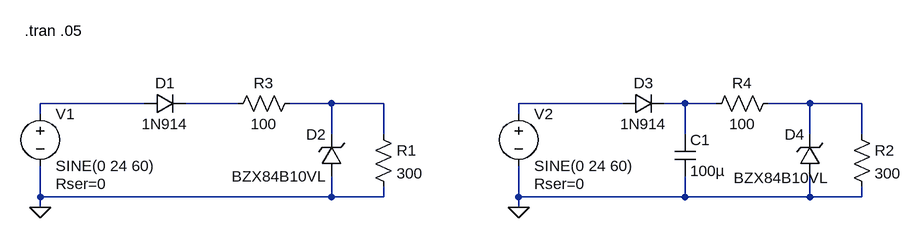
[diagram p0: schematic Diodo - RetificadorMeiaOnda_Regulador_Zener.asc]
Diodo - RetificadorMeiaOnda_Regulador_Zener.asc, the LTspice schematic file:
Version 4
SHEET 1 980 680
WIRE -192 128 -352 128
WIRE -48 128 -128 128
WIRE 96 128 32 128
WIRE 176 128 96 128
WIRE 544 128 384 128
WIRE 640 128 608 128
WIRE 688 128 640 128
WIRE 832 128 768 128
WIRE 912 128 832 128
WIRE -352 144 -352 128
WIRE 384 144 384 128
WIRE 96 176 96 128
WIRE 176 176 176 128
WIRE 640 176 640 128
WIRE 832 176 832 128
WIRE 912 176 912 128
WIRE -352 272 -352 224
WIRE 96 272 96 240
WIRE 96 272 -352 272
WIRE 176 272 176 256
WIRE 176 272 96 272
WIRE 384 272 384 224
WIRE 640 272 640 240
WIRE 640 272 384 272
WIRE 832 272 832 240
WIRE 832 272 640 272
WIRE 912 272 912 256
WIRE 912 272 832 272
WIRE -352 288 -352 272
WIRE 384 288 384 272
FLAG -352 288 0
FLAG 384 288 0
SYMBOL res 160 160 R0
SYMATTR InstName R1
SYMATTR Value 300
SYMBOL diode -192 144 R270
WINDOW 0 32 32 VTop 2
WINDOW 3 0 32 VBottom 2
SYMATTR InstName D1
SYMATTR Value 1N914
SYMBOL voltage -352 128 R0
WINDOW 123 0 0 Left 2
WINDOW 39 24 124 Left 2
SYMATTR SpiceLine Rser=0
SYMATTR InstName V1
SYMATTR Value SINE(0 24 60)
SYMBOL res 48 112 R90
WINDOW 0 0 56 VBottom 2
WINDOW 3 32 56 VTop 2
SYMATTR InstName R3
SYMATTR Value 100
SYMBOL zener 112 240 R180
WINDOW 0 24 64 Left 2
WINDOW 3 24 0 Left 2
SYMATTR InstName D2
SYMATTR Value BZX84B10VL
SYMATTR Description Diode
SYMATTR Type diode
SYMBOL res 896 160 R0
SYMATTR InstName R2
SYMATTR Value 300
SYMBOL diode 544 144 R270
WINDOW 0 32 32 VTop 2
WINDOW 3 0 32 VBottom 2
SYMATTR InstName D3
SYMATTR Value 1N914
SYMBOL voltage 384 128 R0
WINDOW 123 0 0 Left 2
WINDOW 39 24 124 Left 2
SYMATTR SpiceLine Rser=0
SYMATTR InstName V2
SYMATTR Value SINE(0 24 60)
SYMBOL res 784 112 R90
WINDOW 0 0 56 VBottom 2
WINDOW 3 32 56 VTop 2
SYMATTR InstName R4
SYMATTR Value 100
SYMBOL zener 848 240 R180
WINDOW 0 24 64 Left 2
WINDOW 3 -12 -3 Left 2
SYMATTR InstName D4
SYMATTR Value BZX84B10VL
SYMATTR Description Diode
SYMATTR Type diode
SYMBOL cap 624 176 R0
SYMATTR InstName C1
SYMATTR Value 100µ
TEXT -376 16 Left 2 !.tran .05

The netlist it stands for:
* Diodo - RetificadorMeiaOnda_Regulador_Zener.asc
R1 N003 0 300
D1 N001 N002 1N914
V1 N001 0 SINE(0 24 60) Rser=0
R3 N003 N002 100
D2 0 N003 BZX84B10VL
R2 N006 0 300
D3 N004 N005 1N914
V2 N004 0 SINE(0 24 60) Rser=0
R4 N006 N005 100
D4 0 N006 BZX84B10VL
C1 N005 0 100µ
.model D D
.lib standard.dio
.tran .05
.backanno
.end